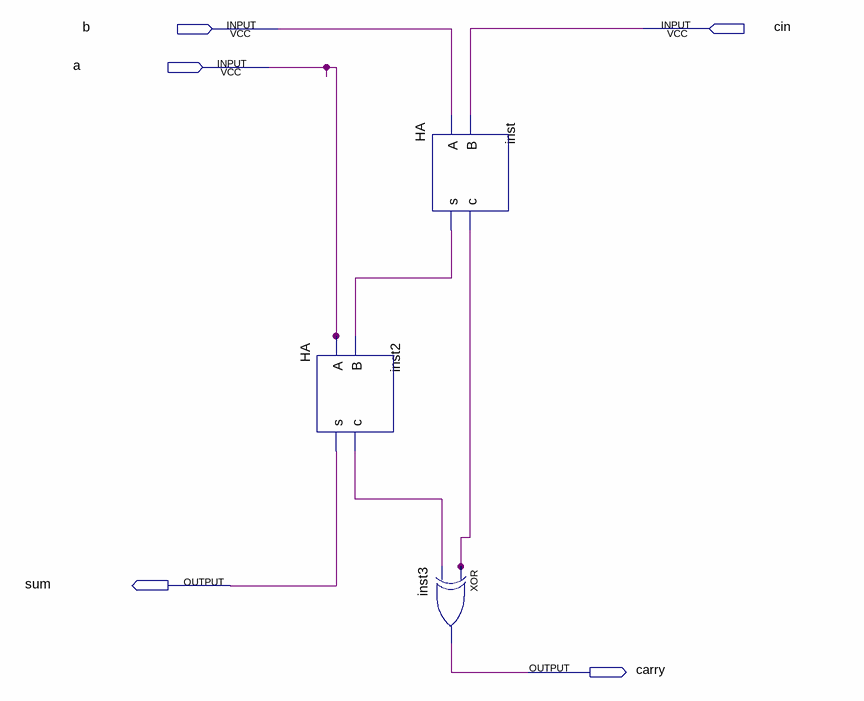
[diagram p0: schematic sheet]
// Quartus schematic FA.bdf as structural Verilog: 3 symbols, 5 pins
module FA (
  input  b,
  input  cin,
  input  a,
  output sum,
  output carry
);

  wire inst2_c, inst_c, inst_s;

  HA inst2 (.A(a), .B(inst_s), .s(sum), .c(inst2_c));
  HA inst (.A(b), .B(cin), .s(inst_s), .c(inst_c));
  xor inst3 (carry, inst_c, inst2_c);
endmodule
